# EAGLE design LB_BIT_w15-NOR-v03(1_2) (EAGLE 6.6.0)
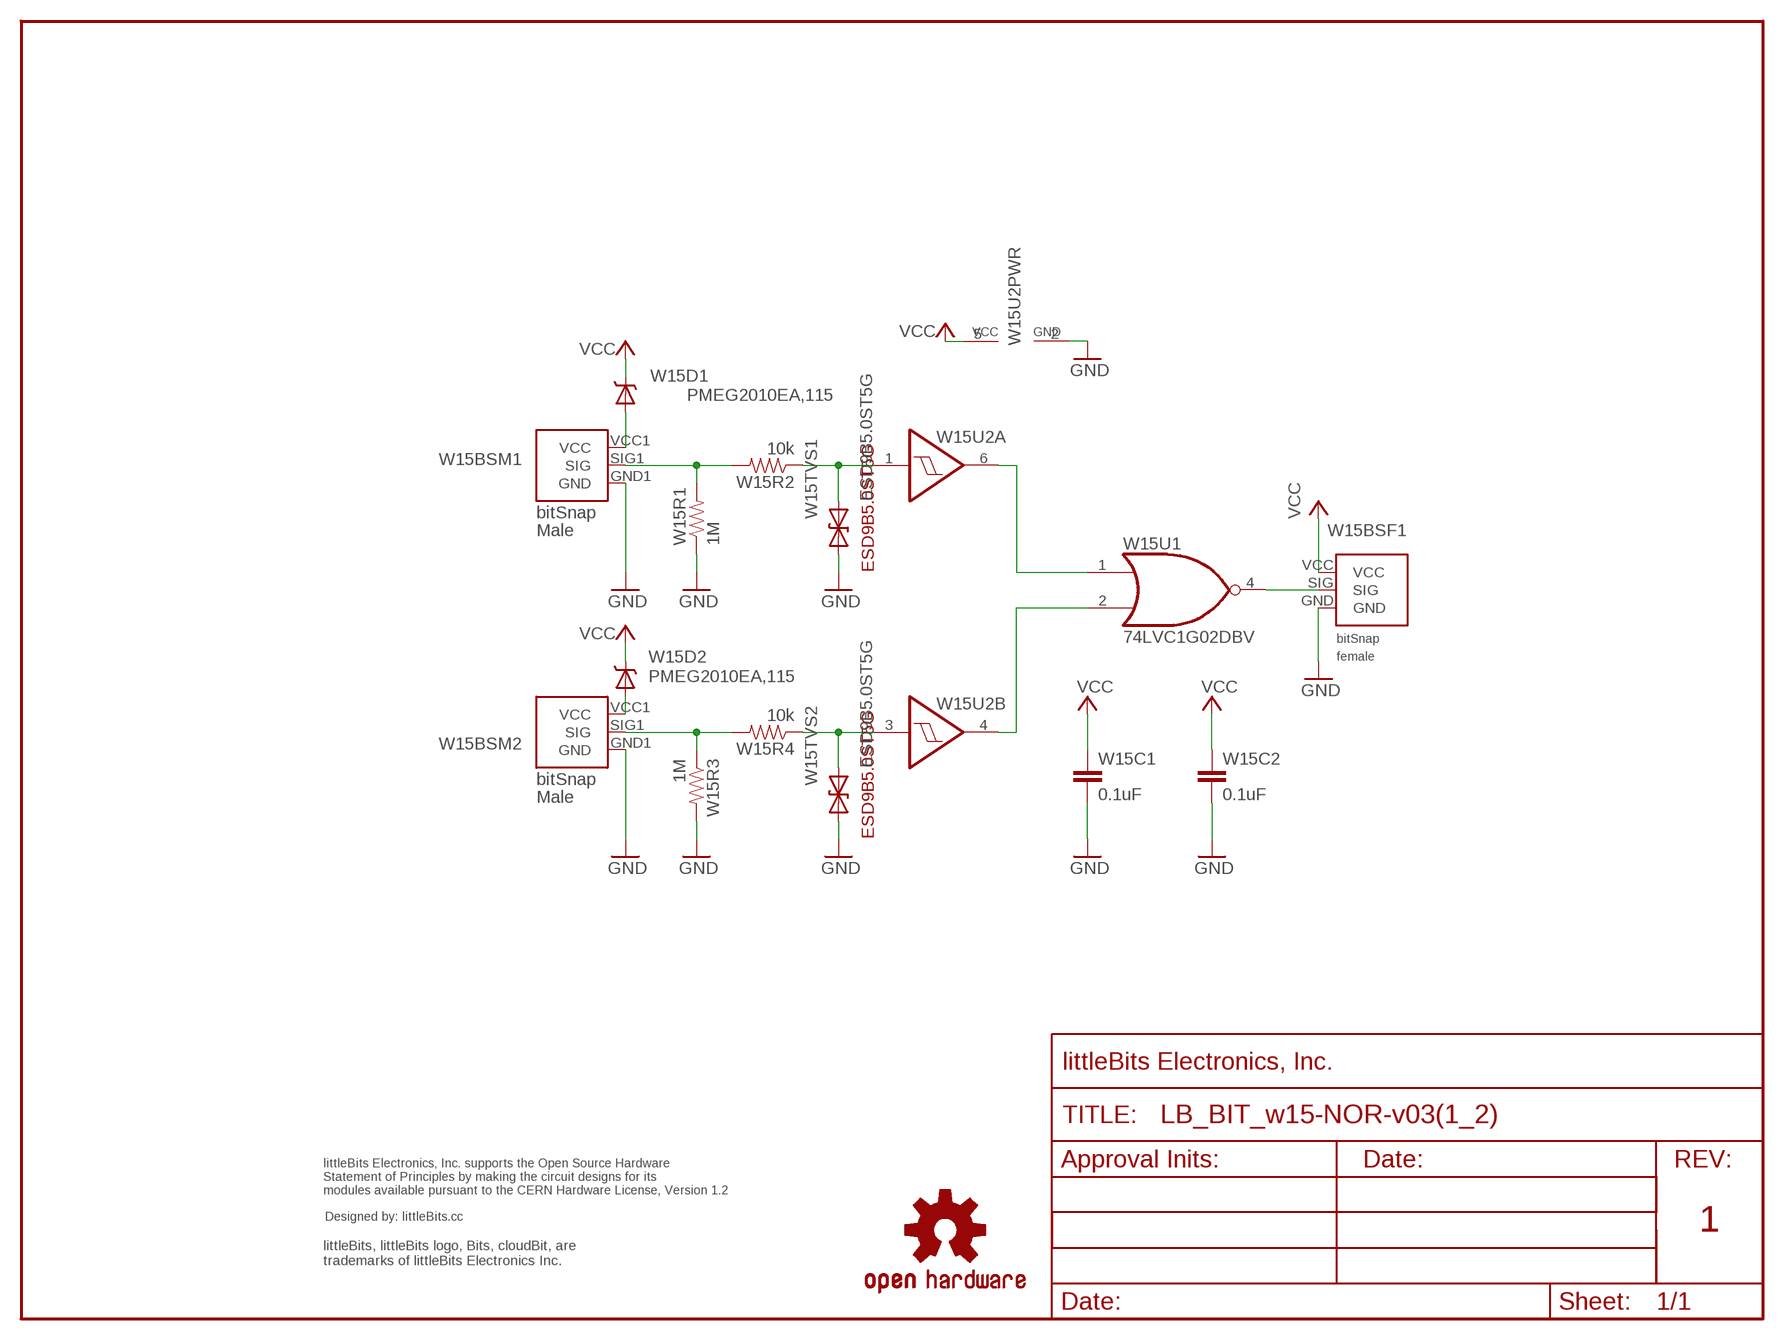
[diagram p0: schematic, sheet 1]

## Parts
U$1  OSHWCREDIT  [OSHWCREDIT]
U$2  OSHW-LOGOL  [OSHW-LOGO-L]
U$7  FRAME-LETTER-OHWOHW  [FABDWG01-OHW]
W15BSF1  BITSNAP_V03_FEMALE  [BITSNAP_V03_FEMALE]
W15BSM1  BITSNAP_V03_MALE  [BITSNAP_V03_MALE]
W15BSM2  BITSNAP_V03_MALE  [BITSNAP_V03_MALE]
W15C1  0.1uF  CAPCAP-0603  [CAP-0603]
W15C2  0.1uF  CAPCAP-0603  [CAP-0603]
W15D1  PMEG2010EA,115  DIODE-SCHOTTKY  [SOD-323]
W15D2  PMEG2010EA,115  DIODE-SCHOTTKY  [SOD-323]
W15R1  1M  RESISTOR0603-RES  [0603-RES]
W15R2  10k  RESISTOR0603-RES  [0603-RES]
W15R3  1M  RESISTOR0603-RES  [0603-RES]
W15R4  10k  RESISTOR0603-RES  [0603-RES]
W15TVS1  ESD9B5.0ST5G  DIODE-TVSSOD-923  [SOD-923]
W15TVS2  ESD9B5.0ST5G  DIODE-TVSSOD-923  [SOD-923]
W15U1  74LVC1G02DBV  [SOT23-5]
W15U2  NC7WZ17  SCHMITT_TRIGGER_NON_INVERTINGNC7WZ17  [SC70-6]

## Nets
GND: W15BSF1.GND W15BSM1.GND1(GND) W15BSM2.GND1(GND) W15C1.2 W15C2.2 W15R1.1 W15R3.2 W15TVS1.1(A) W15TVS2.1(A) W15U2.2(PWR:GND)
N$1: W15BSM2.SIG1(SIG) W15R3.1 W15R4.2
N$2: W15U1.1(I0) W15U2.6(A:O)
N$3: W15BSM1.VCC1(VCC) W15D1.2(A)
N$4: W15U1.2(I1) W15U2.4(B:O)
N$5: W15BSM2.VCC1(VCC) W15D2.2(A)
N$6: W15BSM1.SIG1(SIG) W15R1.2 W15R2.2
N$7: W15R2.1 W15TVS1.2(C) W15U2.1(A:I)
N$8: W15R4.1 W15TVS2.2(C) W15U2.3(B:I)
N$9: W15BSF1.SIG W15U1.4(O)
VCC: W15BSF1.VCC W15C1.1 W15C2.1 W15D1.1(C) W15D2.1(C) W15U2.5(PWR:VCC)

## Notes on the sheet
- 1

## Power pins joined to a net without a drawn wire
GND: W15U1.3(GND)
VCC: W15U1.5(VCC)

## Library data of the parts
U$1 = LITTLEBITS:OSHWCREDIT
U$2 = SparkFun_NEW:OSHW-LOGO: Open Source Hardware Logo This logo indicates the piece of hardware it is found on incorporates a OSHW license and/or adheres to the definition of open source hardware found here: http://freedomdefined.org/OSHW
U$7 = LITTLEBITS:FRAME-LETTER-OHW
W15BSF1 = bitSnap:BITSNAP_V03_FEMALE
W15BSM1 W15BSM2 = bitSnap:BITSNAP_V03_MALE
W15C1 W15C2 = LITTLEBITS:CAP
W15D1 W15D2 = LITTLEBITS:DIODE-SCHOTTKY
W15R1-W15R4 = SparkFun:RESISTOR: Resistor Basic schematic elements and footprints for 0603, 1206, and PTH 1/10th watt (small) resistors.
W15TVS1 W15TVS2 = LITTLEBITS:DIODE-TVS: Bidirectional Transient Voltage Suppression Diode: Device conducts in avalanche mode after reaching a part dependent voltage threshold. Used for limiting voltage spikes on ESD sensitive inputs and outputs.; IEC_ESD_PROT0: +/-18kV; LB_PN: ?; MPN: ESD9B5.0ST5G; V_CLAMP: ?; V_OPERATION: 5V
W15U1 = 74xx-little-us:74*1G02: 2-input NOR gate
W15U2 = LITTLEBITS:SCHMITT_TRIGGER_NON_INVERTING

## Board
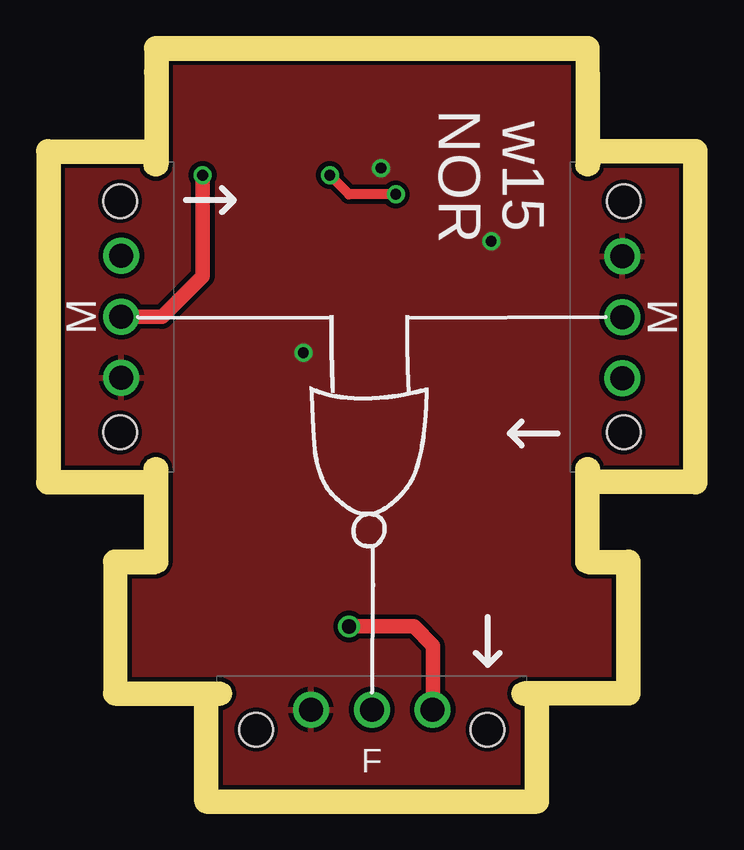
[diagram p1: board, top side]
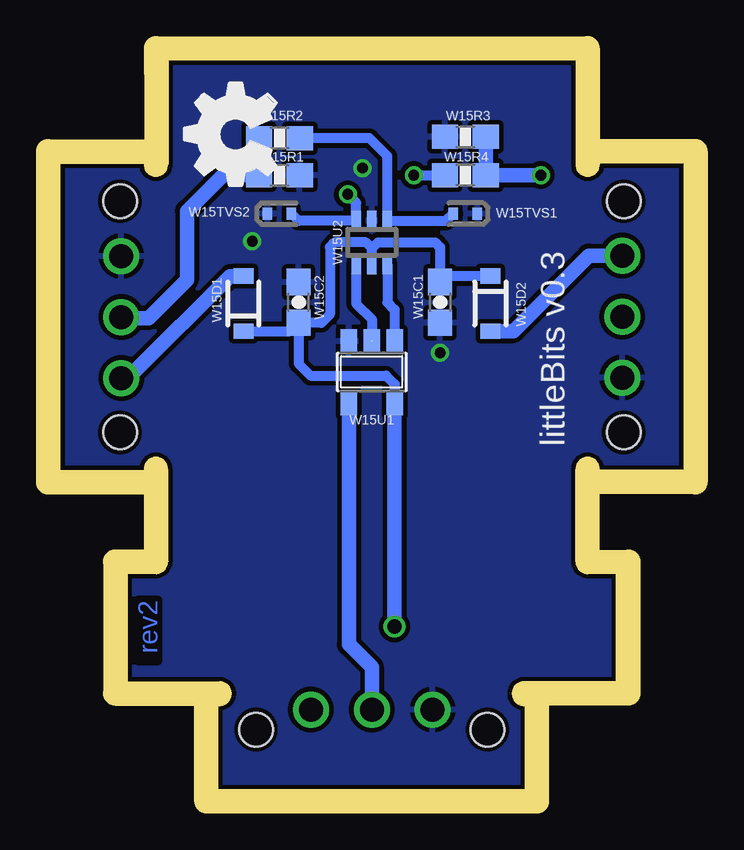
[diagram p2: board, bottom side, seen from below]

Size 26 x 30.4 mm. Coordinates in mm from the lower left corner, seen from the top.
Outline: 2.8,4.5 2.8,9 4,9 arc90 4.5,9.5 4.5,9.51
Outline: 23.2,4.5 23.2,9 22,9 arc-90 21.5,9.5 21.5,9.51
Outline: 4.5,29.9 4.5,30.4 21.5,30.4 21.5,29.9
Copper layers (1*16): Top 0.035mm / dielectric 1.5mm / Bottom 0.035mm
Design rules "littleBitsDRC": minimum track width 0.2mm, minimum drill 0.4mm, track to track 0.2mm, track to pad 0.2mm, pad to pad 0.2mm, via to via 0.2mm, smd to smd 0mil, copper to edge 0.2mm, drill to drill 0.2mm, minimum pad ring 0.2mm, minimum via ring 0.15mm, stop-mask expansion 0.1mm, vias tented up to drill 0mil, thermal gap 0.2mm
Milling: 9 lines

### Footprints (pad centres in the part's own frame; a part is rotated, then mirrored left to right if it is on the bottom)
BITSNAP_V03_FEMALE = drill 1: GND 3.91,3.33; SIG 6.45,3.33; VCC 8.99,3.33 | hole 1.4: 1.63,2.5; 11.27,2.5
BITSNAP_V03_MALE = drill 1: GND1 8.98,2.56; SIG1 6.44,2.56; VCC1 3.9,2.56 | hole 1.4: 11.27,2.5; 1.63,2.5
CAP-0603 = smd 1.1 x 1: 1 -0.85,0; 2 0.85,0
SOD-323 = smd 0.63 x 0.83: 1 -1.15,0; 2 1.15,0
0603-RES = smd 1.1 x 1: 1 -0.85,0; 2 0.85,0
SOD-923 = smd 0.4 x 0.5: 1 -0.5,0; 2 0.5,0
SOT23-5 = smd 0.69 x 0.99: 1 -0.95,-1.29; 2 0,-1.29; 3 0.95,-1.29; 4 0.95,1.3; 5 -0.95,1.3
SC70-6 = smd 0.4 x 0.85: 1 -0.65,-0.9; 2 0,-0.9; 3 0.65,-0.9; 4 0.65,0.9; 5 0,0.9; 6 -0.65,0.9

### Placement (x,y rotation side)
U$1  -91.55,-62.4 0 top  (outside the outline)
U$2  -32.32,-66.26 0 top  (outside the outline)
U$4  [NOR_IMAGE]  10.4,19.75 270 top
U$6  [OSHW_FILLX150_NOTEXT]  17,24.35 0 top
U$7  -2.2,0 0 top
W15BSF1  6.55,0 0 top
W15BSM1  26,13.25 90 top
W15BSM2  0,26.15 270 top
W15C1  10.15,20.3 270 bottom
W15C2  16.05,20.3 90 bottom
W15D1  18.35,20.25 90 bottom
W15D2  8.05,20.25 270 bottom
W15R1  16.85,25.6 180 bottom
W15R2  16.85,27.15 180 bottom
W15R3  9.1,27.2 180 bottom
W15R4  9.1,25.6 0 bottom
W15TVS1  9.1,24 180 bottom
W15TVS2  16.85,24 0 bottom
W15U1  13,17.4 180 bottom
W15U2  13,22.8 180 bottom

### Tracks (layer width: path | path; a pad name or v marks a point on that pad's centre or on a via)
GND  (via drill 0.45)
  other vias: 10.15,18.2 17.98,22.85 13.38,25.9
  pour Top: 0.27,30.25 25.7,30.25 25.7,0.22 0.27,0.27
  pour Bottom: 0.27,30.25 25.7,30.25 25.7,0.22 0.27,0.27
N$1  (via drill 0.45)
  Top 0.61: v5.95,25.6 5.95,21.4 4.25,19.7 W15BSM2.SIG1
  Bottom 0.61: W15R3.1 W15R4.2 v5.95,25.6
N$2
  Bottom 0.406: W15U2.6 12.35,20.3 12.05,20 W15U1.1
N$3
  Bottom 0.61: W15D1.2 18.9,21.4 22.96,17.34 23.25,17.34 W15BSM1.VCC1
N$4
  Bottom 0.406: W15U2.4 13.65,20.25 13,19.6 W15U1.2
N$5
  Bottom 0.61: W15D2.2 7.1,19.1 3.95,22.25 W15BSM2.VCC1
N$6
  Bottom 0.61: W15R2.2 W15R1.2 19.2,25.6 20.7,24.1 20.7,21.25 22.3,19.65 23.4,19.65 W15BSM1.SIG1
N$7
  Bottom 0.406: W15TVS1.2 9.9,23.7 W15U2.1 12.35,26.4 13.1,27.15 W15R2.1
N$8  (via drill 0.45)
  Top 0.406: v14,24.8 12.05,24.8 v11.25,25.6
  Bottom 0.406: W15TVS2.2 16.05,23.7 W15U2.3 13.65,24.45 v14,24.8 | v11.25,25.6 W15R4.1
N$9
  Bottom 0.61: W15U1.4 13.95,6.05 13,5.1 W15BSF1.SIG
VCC  (via drill 0.6)
  Top 0.61: v12.05,6.8 14.75,6.8 15.55,6 W15BSF1.VCC
  Bottom 0.406: W15D2.1 9.9,21.4 W15C1.1 10.15,22.6 10.35,22.8 12.75,22.8 13,22.55 | W15D1.1 16.4,19.1 W15C2.1 | W15C2.1 16.05,17.75 15.55,17.25 12.4,17.25 12.05,16.9 W15U1.5 | W15U2.5 13,22.55 | 13,22.55 13.25,22.8 14.55,22.8 14.75,22.6 14.75,19.8 15.1,19.45 W15C2.1
  Bottom 0.61: W15U1.5 v12.05,6.8

### Text on the board
Bottom: rev2
tPlace: w15 / NOR
bPlace: littleBits v0.3
Milling: 1mm DIA. ROUTER PATH
Reference: LARGE
dxf: 2 | NOT OR Bit
tDocu: W15BSM1 / (ORANGE) | W15BSM2 / (ORANGE) | W15BSF1 / (ORANGE) | W15-NOR TOP
bDocu: W15-NOR BOTTOM